# Altium schematic sheet 2020年电赛校赛数字板.SchDoc
size A4; DocumentNumber: 5; Revision: V1.0; SheetNumber: 5; SheetTotal: 5
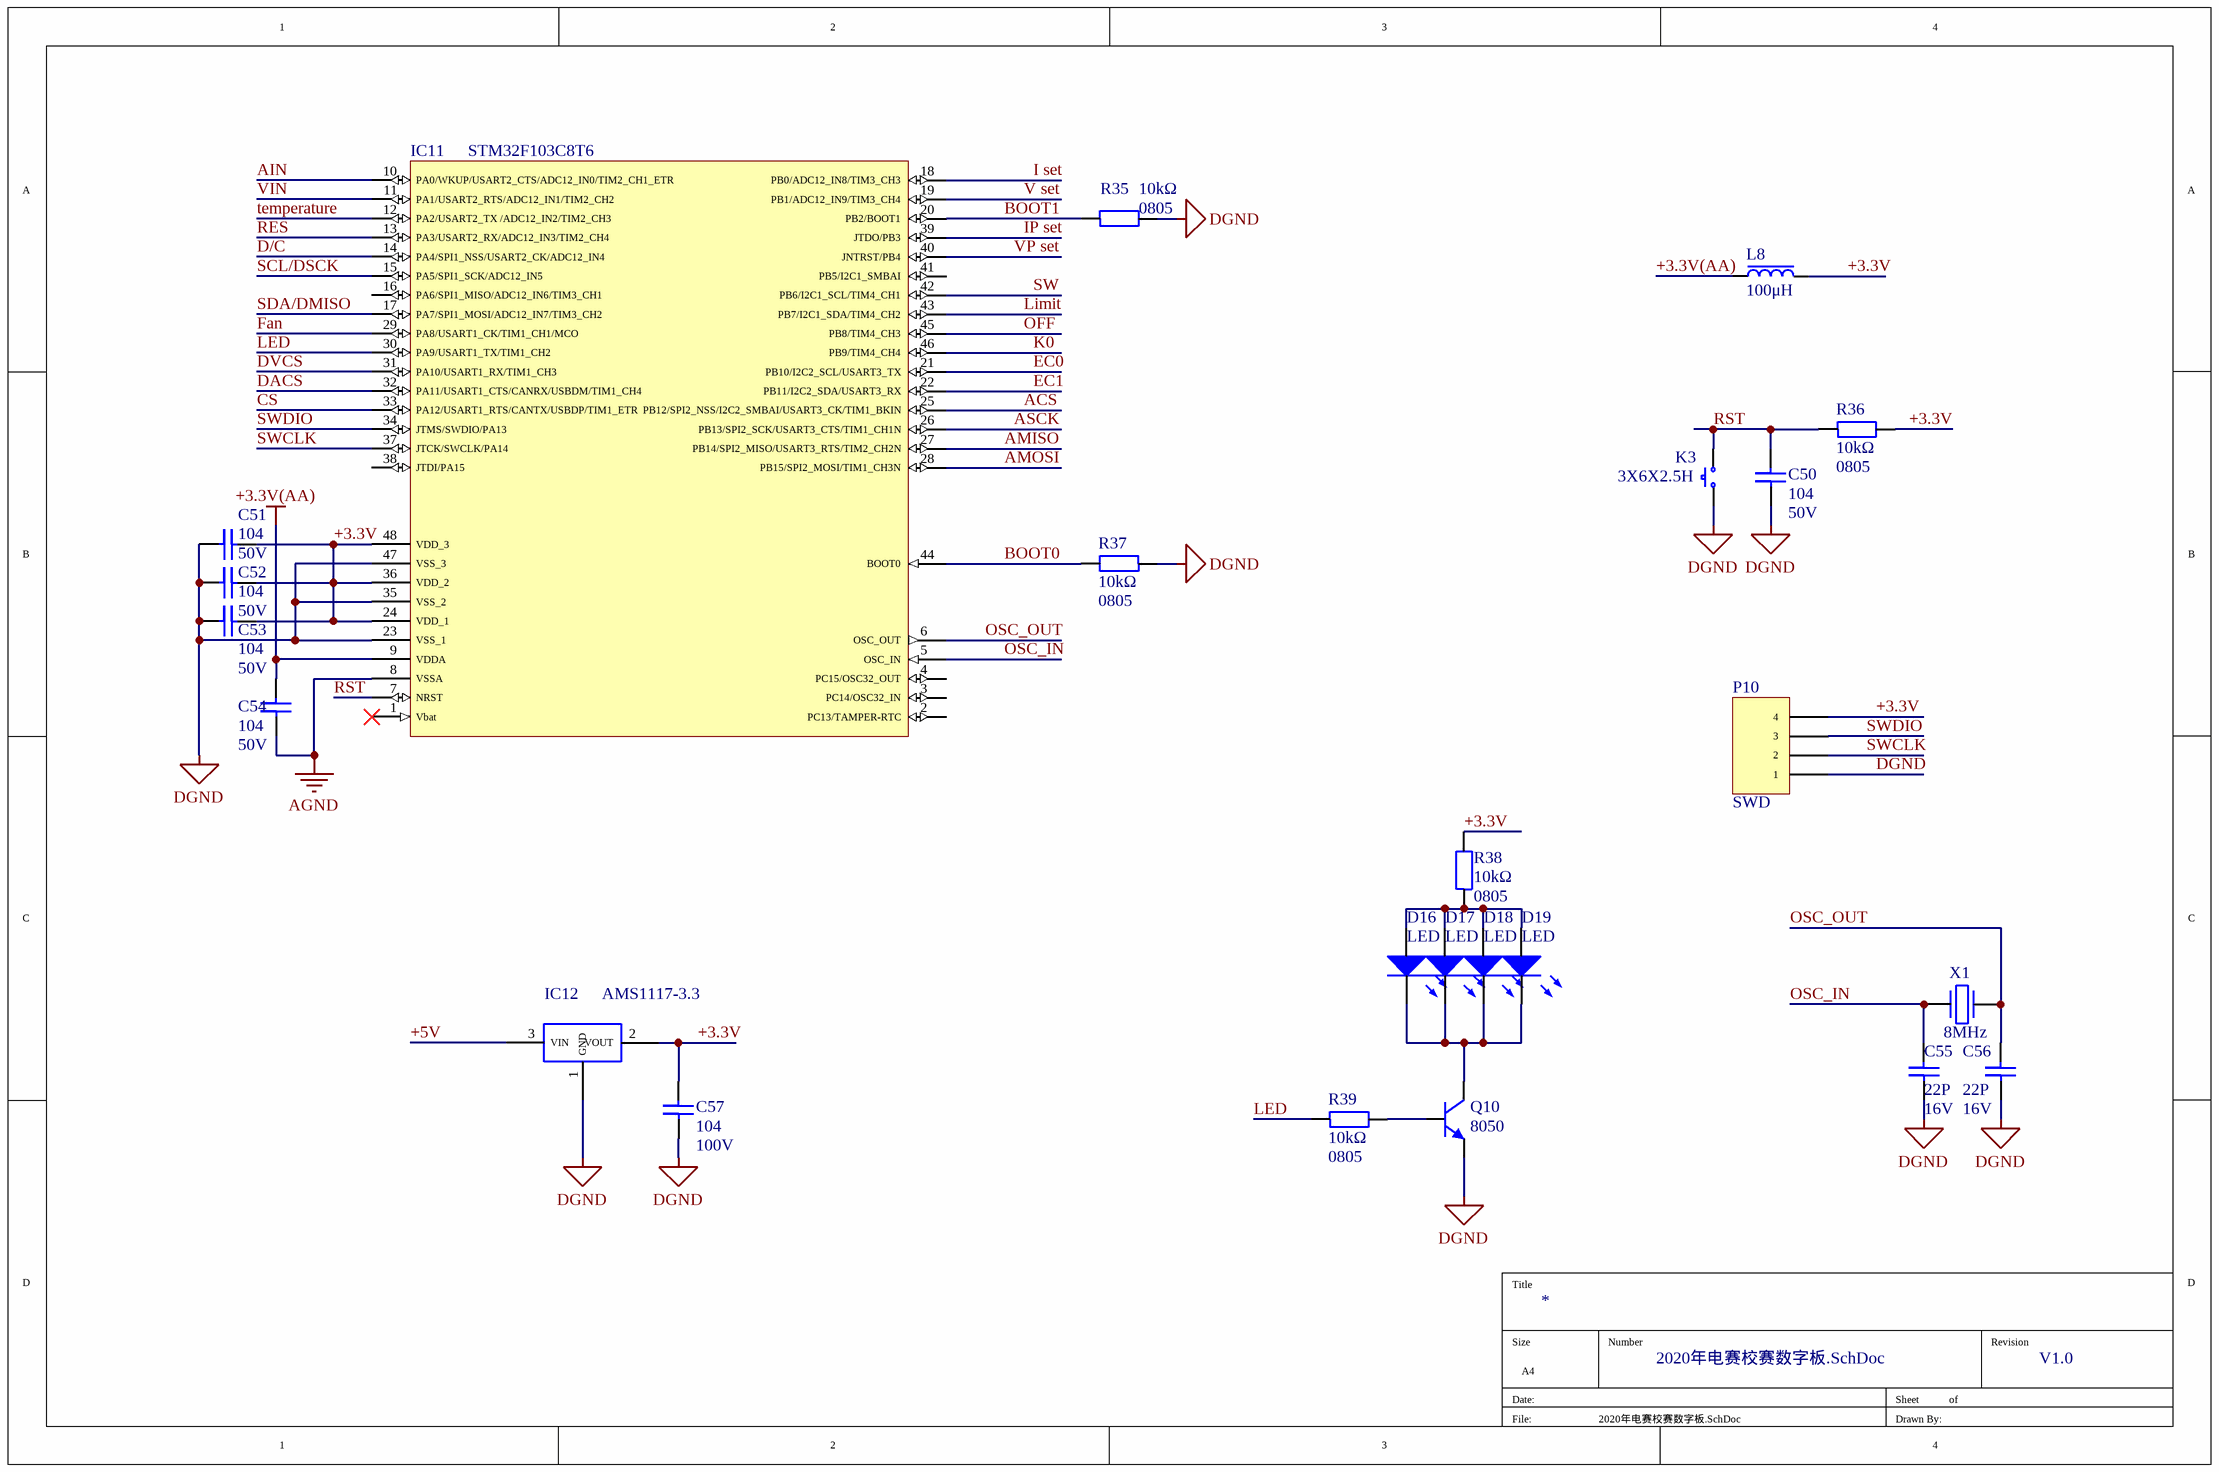
[diagram p0: 2020年电赛校赛数字板.SchDoc]

## Parts
C50  104  value 50V  [C0805]
C51  104  value 50V  [C0805]
C52  104  value 50V  [C0805]
C53  104  value 50V  [C0805]
C54  104  value 50V  [C0805]
C55  22P  value 16V  [C0805]
C56  22P  value 16V  [C0805]
C57  104  value 100V  [C0805]
D16  LED  [LED0805(反贴)]
D17  LED  [LED0805(反贴)]
D18  LED  [LED0805(反贴)]
D19  LED  [LED0805(反贴)]
IC11  STM32F103C8T6  [LQFP-48(0.5MM) - duplicate]
IC12  AMS1117-3.3  [SOT-89]
K3  3X6X2.5H  [3X6X2.5H]
L8  100μH  [R0805]
P10  SWD  [HDR2.54-LI-4P]
Q10  8050  [SOT-23]
R35  10kΩ  value 0805  [R0805]
R36  10kΩ  value 0805  [R0805]
R37  10kΩ  value 0805  [R0805]
R38  10kΩ  value 0805  [R0805]
R39  10kΩ  value 0805  [R0805]
X1  8MHz  [Crystal 3225-4P]

## Nets
+3.3V(AA): C54.2 IC11.9(VDDA) L8.2
AGND: C54.1 IC11.8(VSSA)
DGND: C50.1 C51.1 C52.1 C53.1 C55.1 C56.1 C57.1 IC11.23(VSS_1) IC11.35(VSS_2) IC11.47(VSS_3) IC12.1(GND) K3.1 P10.1 Q10.2(E) R35.2 R37.1
+3.3V: C51.2 C52.2 C53.2 C57.2 IC11.24(VDD_1) IC11.36(VDD_2) IC11.48(VDD_3) IC12.2(VOUT) L8.1 P10.4 R36.2 R38.2
+5V: IC12.3(VIN)
ACS: IC11.25(PB12/SPI2_NSS/I2C2_SMBAI/USART3_CK/TIM1_BKIN)
AIN: IC11.10(PA0/WKUP/USART2_CTS/ADC12_IN0/TIM2_CH1_ETR)
AMISO: IC11.27(PB14/SPI2_MISO/USART3_RTS/TIM2_CH2N)
AMOSI: IC11.28(PB15/SPI2_MOSI/TIM1_CH3N)
ASCK: IC11.26(PB13/SPI2_SCK/USART3_CTS/TIM1_CH1N)
BOOT0: IC11.44(BOOT0) R37.2
BOOT1: IC11.20(PB2/BOOT1) R35.1
CS: IC11.33(PA12/USART1_RTS/CANTX/USBDP/TIM1_ETR)
D/C: IC11.14(PA4/SPI1_NSS/USART2_CK/ADC12_IN4)
DACS: IC11.32(PA11/USART1_CTS/CANRX/USBDM/TIM1_CH4)
DVCS: IC11.31(PA10/USART1_RX/TIM1_CH3)
EC0: IC11.21(PB10/I2C2_SCL/USART3_TX)
EC1: IC11.22(PB11/I2C2_SDA/USART3_RX)
Fan: IC11.29(PA8/USART1_CK/TIM1_CH1/MCO)
I set: IC11.18(PB0/ADC12_IN8/TIM3_CH3)
IP set: IC11.39(JTDO/PB3)
K0: IC11.46(PB9/TIM4_CH4)
LED: IC11.30(PA9/USART1_TX/TIM1_CH2) R39.1
Limit: IC11.43(PB7/I2C1_SDA/TIM4_CH2)
OFF: IC11.45(PB8/TIM4_CH3)
OSC_IN: C55.2 IC11.5(OSC_IN) X1.2
OSC_OUT: C56.2 IC11.6(OSC_OUT) X1.1
RES: IC11.13(PA3/USART2_RX/ADC12_IN3/TIM2_CH4)
RST: C50.2 IC11.7(NRST) K3.2 R36.1
SCL/DSCK: IC11.15(PA5/SPI1_SCK/ADC12_IN5)
SDA/DMISO: IC11.17(PA7/SPI1_MOSI/ADC12_IN7/TIM3_CH2)
SW: IC11.42(PB6/I2C1_SCL/TIM4_CH1)
SWCLK: IC11.37(JTCK/SWCLK/PA14) P10.2
SWDIO: IC11.34(JTMS/SWDIO/PA13) P10.3
temperature: IC11.12(PA2/USART2_TX_/ADC12_IN2/TIM2_CH3)
V set: IC11.19(PB1/ADC12_IN9/TIM3_CH4)
VIN: IC11.11(PA1/USART2_RTS/ADC12_IN1/TIM2_CH2)
VP set: IC11.40(JNTRST/PB4)
NetD16_1: D16.1(A) D17.1(A) D18.1(A) D19.1(A) R38.1
NetD16_2: D16.2(K) D17.2(K) D18.2(K) D19.2(K) Q10.3(C)
NetQ10_1: Q10.1(B) R39.2

Not connected (* = marked no-connect by the designer): IC11 1(Vbat)* 2(PC13/TAMPER-RTC) 3(PC14/OSC32_IN) 4(PC15/OSC32_OUT) 16(PA6/SPI1_MISO/ADC12_IN6/TIM3_CH1) 38(JTDI/PA15) 41(PB5/I2C1_SMBAI)

## Library data of the parts
C50-C57 = 104: 无极性电容
IC11 = STM32F103C8T6: STM32单片机
IC12 = AMS1117-3.3: LDO
K3 = 3X6X2.5H: 贴片按键
L8 = 470mH: 电感
P10 = Header 4: Header, 4-Pin; LatestRevisionDate: 17-Jul-2002; LatestRevisionNote: Re-released for DXP Platform.; Publisher: Altium Limited
Q10 = NPN: 三极管
R35-R39 = 10kΩ: 贴片/直插电阻
X1 = 8MHz: 无源晶振